# EasyEDA schematic RC PCB.json
TITLE: Sheet_1; REV: 1.0; Date: 2024-03-03; Sheet: 1/1; Drawn By: as7764; Company: Your Company
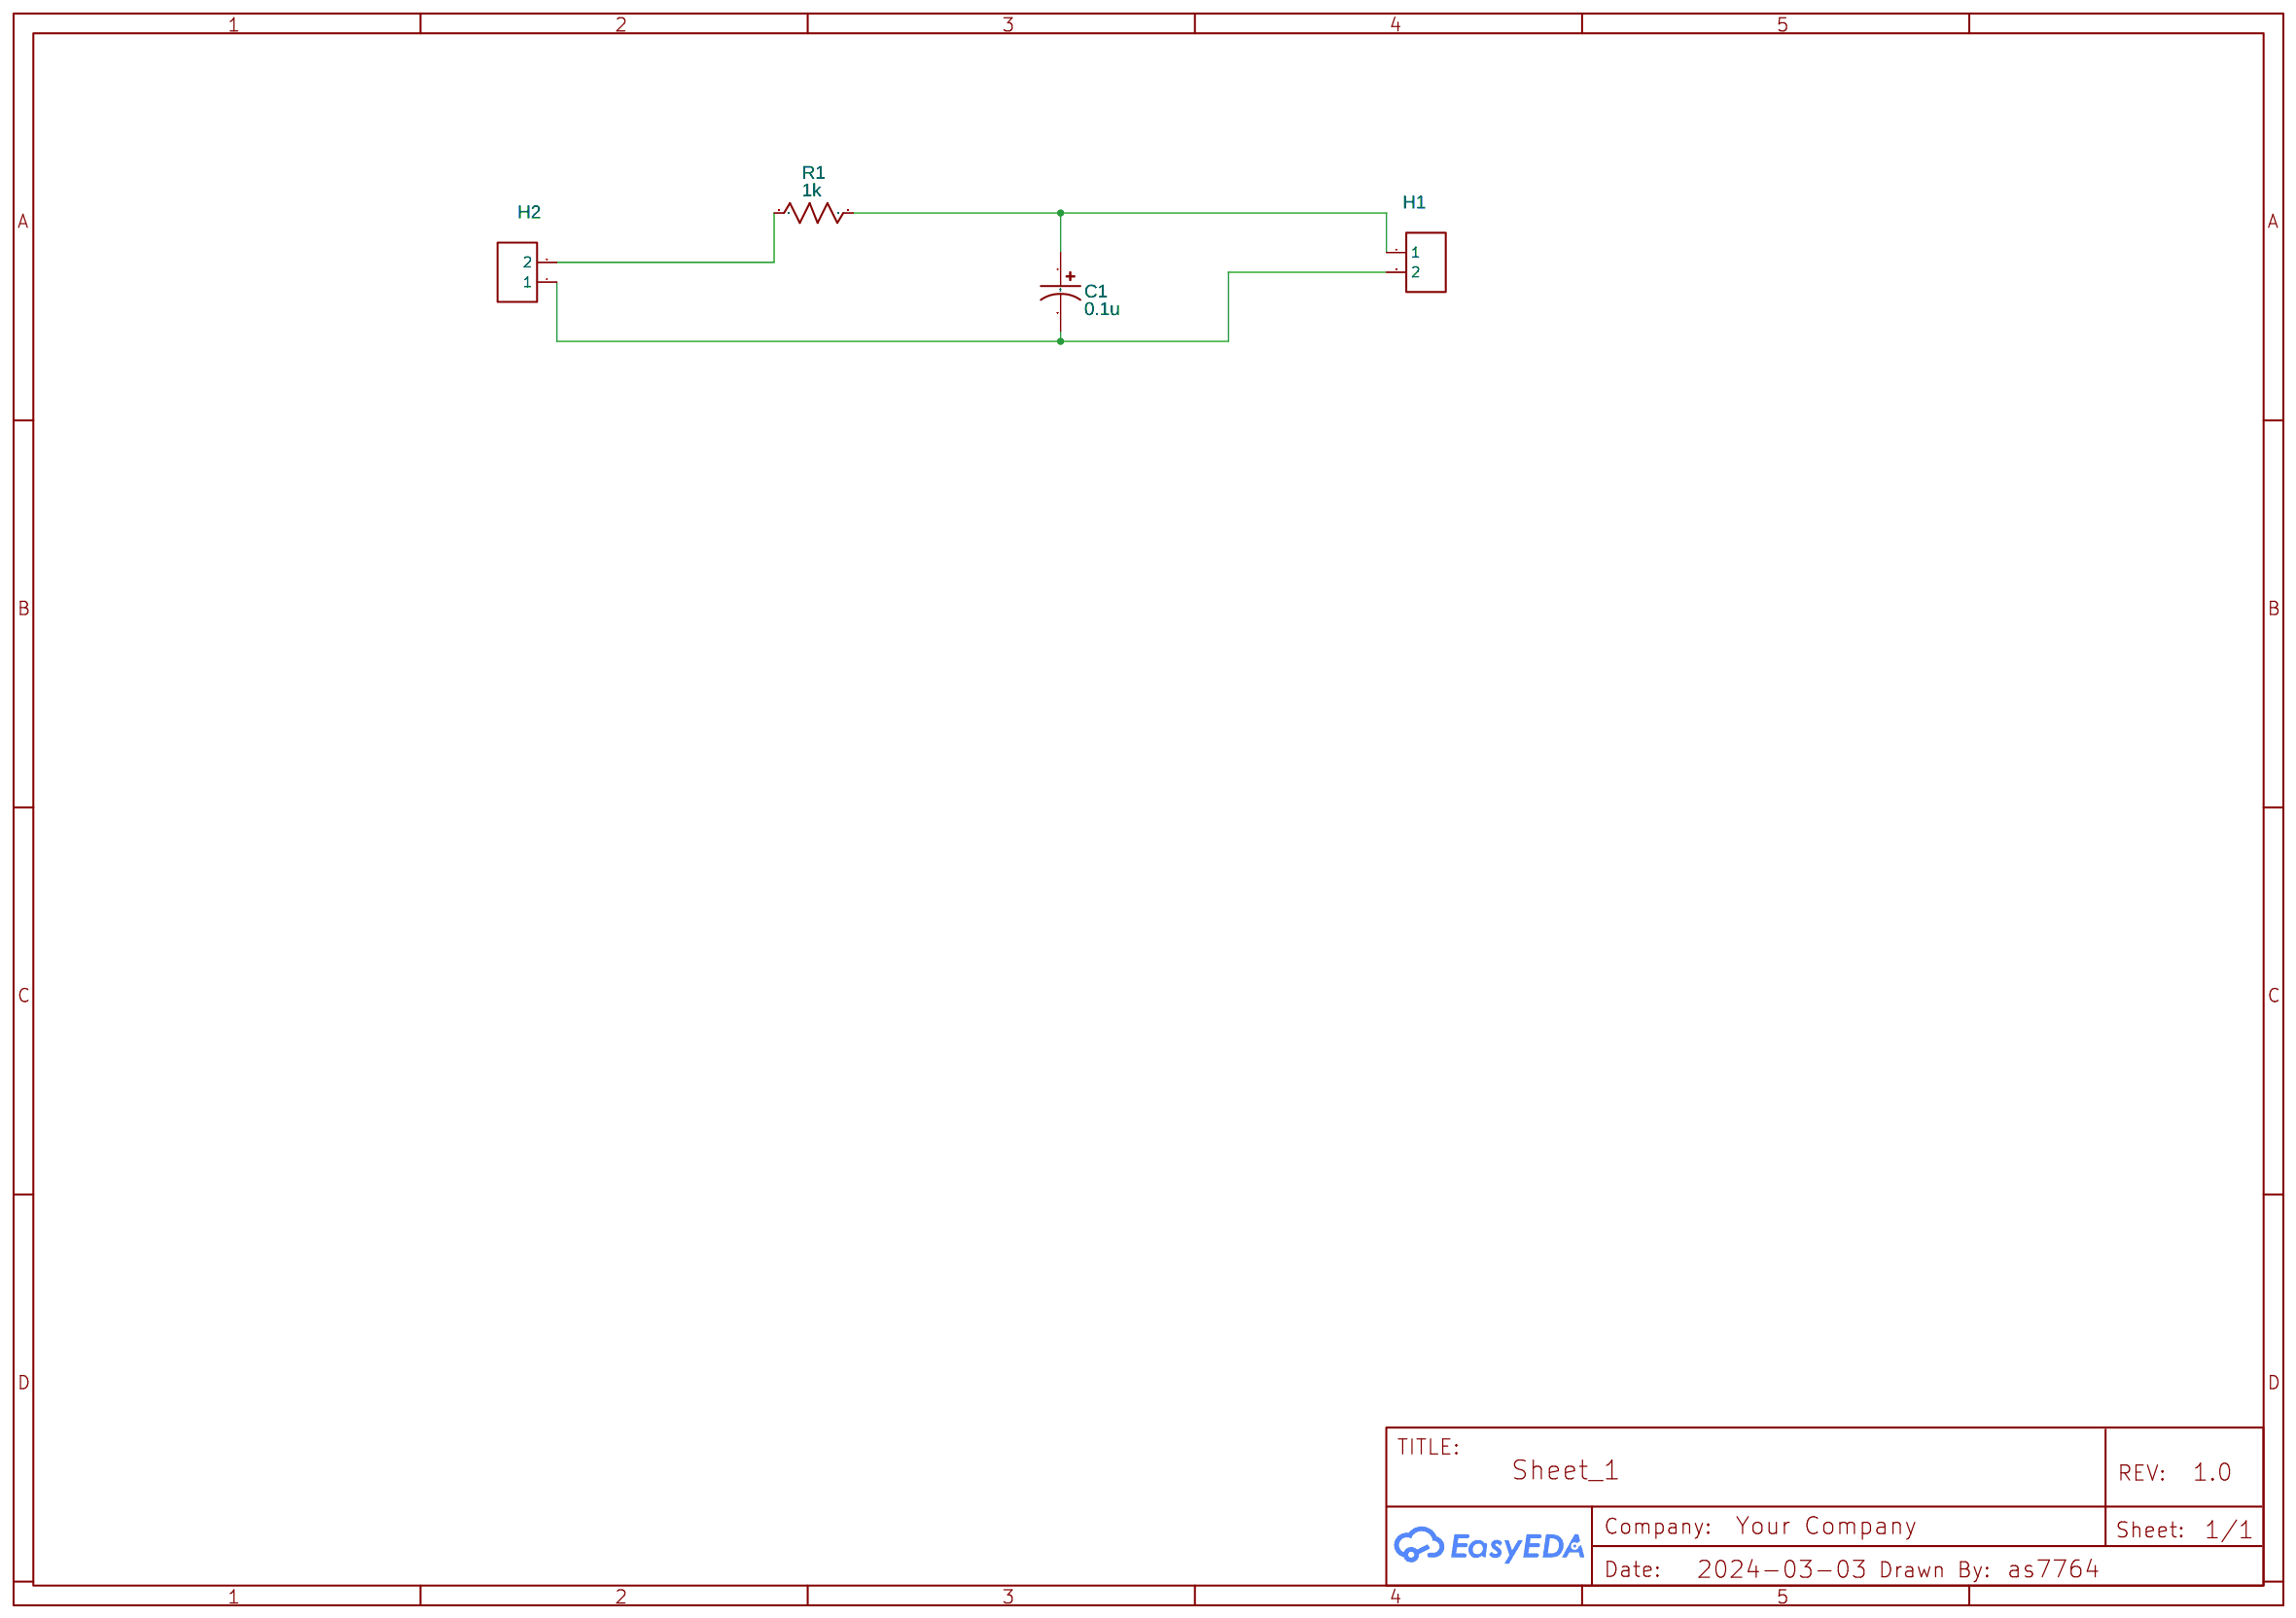
[diagram p0: schematic sheet]

## Parts
C1  0.1u  [CAP-D3.0×F1.5]
H1  HDR-F-2.54_1x2  [HDR-F-2.54_1X2]
H2  HDR-F-2.54_1x2  [HDR-F-2.54_1X2]
R1  1k  [R_AXIAL-0.3]

## Library data of the parts
C1 = CE_TH_D3.0×F1.5_US: Contributor: LCEDA_Lib; Package Display: No
H1 H2 = HDR-F-2.54_1x2: Supplier Part: C49661; Supplier: LCSC; Contributor: LCEDA_Lib; Package Display: No
R1 = R_AXIAL-0.3_US: Contributor: LCEDA_Lib; Package Display: No

## Nets
Net-(C1-1): C1.1 H1.1 R1.2
Net-(C1-2): C1.2 H1.2 H2.1
Net-(H2-2): H2.2 R1.1
